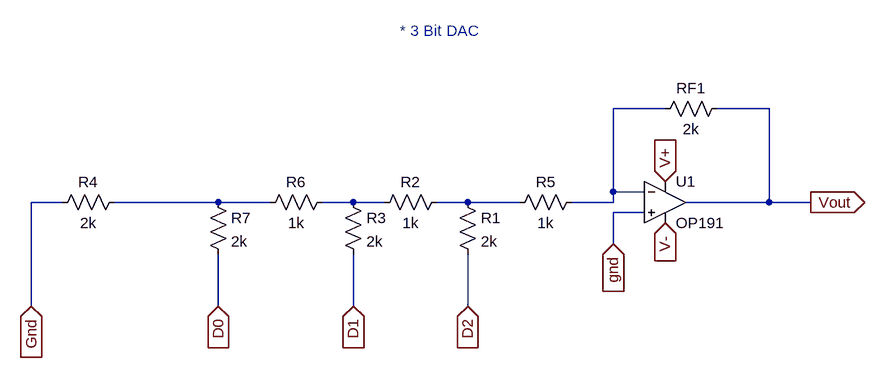
[diagram p0: schematic 3bitDAC.asc]
3bitDAC.asc, the LTspice schematic file:
Version 4
SHEET 1 944 680
WIRE 608 0 528 0
WIRE 768 0 688 0
WIRE 528 128 528 0
WIRE 576 128 528 128
WIRE -320 144 -368 144
WIRE -80 144 -240 144
WIRE 0 144 -80 144
WIRE 128 144 80 144
WIRE 176 144 128 144
WIRE 304 144 256 144
WIRE 384 144 304 144
WIRE 528 144 528 128
WIRE 528 144 464 144
WIRE 768 144 768 0
WIRE 768 144 640 144
WIRE 832 144 768 144
WIRE 576 160 528 160
WIRE 528 208 528 160
WIRE -368 304 -368 144
WIRE -80 304 -80 224
WIRE 128 304 128 224
WIRE 304 304 304 224
FLAG 608 112 V+
IOPIN 608 112 In
FLAG 608 176 V-
IOPIN 608 176 In
FLAG 832 144 Vout
IOPIN 832 144 Out
FLAG -80 304 D0
IOPIN -80 304 In
FLAG 128 304 D1
IOPIN 128 304 In
FLAG -368 304 Gnd
IOPIN -368 304 In
FLAG 528 208 gnd
IOPIN 528 208 In
FLAG 304 304 D2
IOPIN 304 304 In
SYMBOL res 288 128 R0
SYMATTR InstName R1
SYMATTR Value 2k
SYMATTR SpiceLine tol=5kohms
SYMBOL res 272 128 R90
WINDOW 0 0 56 VBottom 2
WINDOW 3 32 56 VTop 2
SYMATTR InstName R2
SYMATTR Value 1k
SYMATTR SpiceLine tol=5kohms
SYMBOL res 112 128 R0
SYMATTR InstName R3
SYMATTR Value 2k
SYMATTR SpiceLine tol=5kohms
SYMBOL res -224 128 R90
WINDOW 0 0 56 VBottom 2
WINDOW 3 32 56 VTop 2
SYMATTR InstName R4
SYMATTR Value 2k
SYMBOL res 704 -16 R90
WINDOW 0 0 56 VBottom 2
WINDOW 3 32 56 VTop 2
SYMATTR InstName RF1
SYMATTR Value 2k
SYMBOL OpAmps\\OP191 608 80 R0
SYMATTR InstName U1
SYMBOL res 480 128 R90
WINDOW 0 0 56 VBottom 2
WINDOW 3 32 56 VTop 2
SYMATTR InstName R5
SYMATTR Value 1k
SYMBOL res 96 128 R90
WINDOW 0 0 56 VBottom 2
WINDOW 3 32 56 VTop 2
SYMATTR InstName R6
SYMATTR Value 1k
SYMBOL res -96 128 R0
SYMATTR InstName R7
SYMATTR Value 2k
TEXT 200 -120 Left 2 ;* 3 Bit DAC

The netlist it stands for:
* 3bitDAC.asc
R1 N004 D2 2k tol=5kohms
R2 N004 N003 1k tol=5kohms
R3 N003 D1 2k tol=5kohms
R4 N002 Gnd 2k
RF1 Vout N001 2k
XU1 Gnd N001 V+ V- Vout OP191  ; pins In+ In- V+ V- OUT
R5 N001 N004 1k
R6 N003 N002 1k
R7 N002 D0 2k
* * 3 Bit DAC
.lib ADI.lib
.backanno
.end